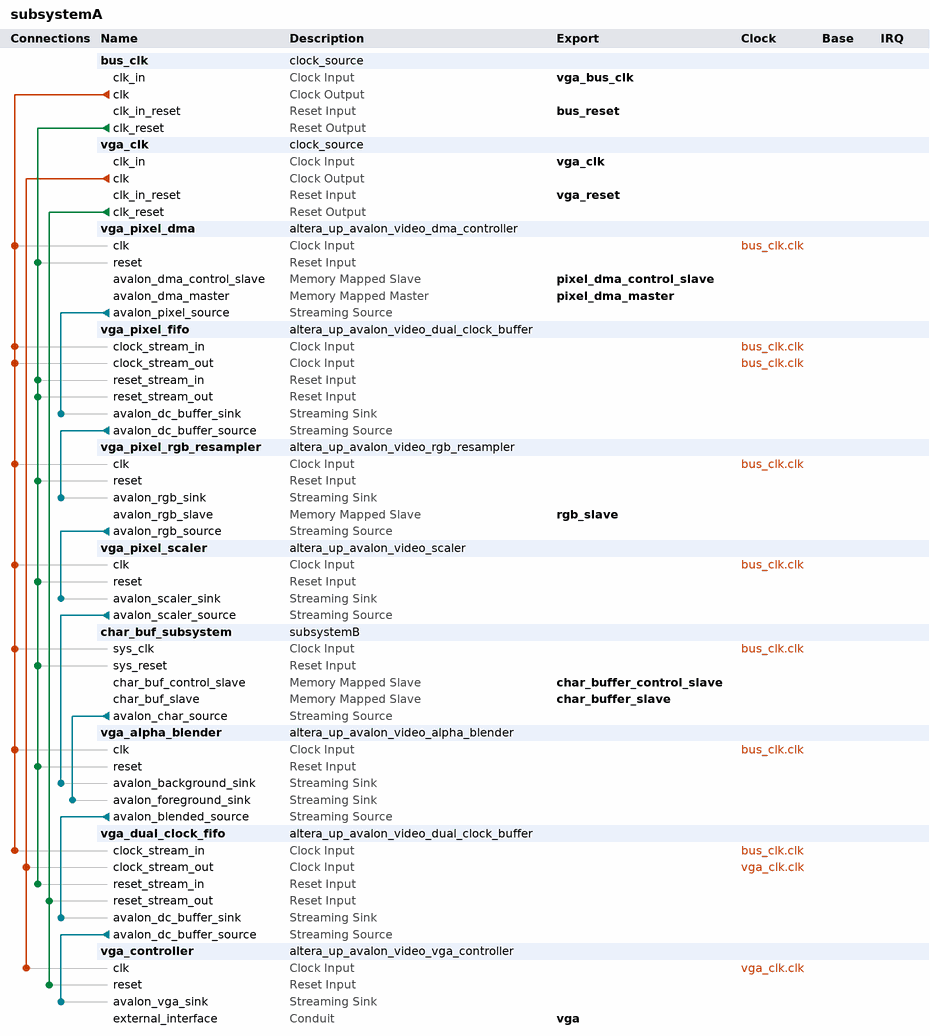
[diagram p0: system contents]
# Platform Designer (Qsys) system subsystemA, Cyclone IV E EP4CE115F29C7
# Parameters at their usual value, and those the tool derives, are not listed.
package require -exact qsys 18.0
create_system subsystemA
set_project_property DEVICE_FAMILY {Cyclone IV E}
set_project_property DEVICE EP4CE115F29C7

add_instance bus_clk clock_source 18.1
set_instance_parameter_value bus_clk clockFrequency 50000000

add_instance vga_clk clock_source 18.1
set_instance_parameter_value vga_clk clockFrequency 25000000

add_instance vga_pixel_dma altera_up_avalon_video_dma_controller 18.0
set_instance_parameter_value vga_pixel_dma addr_mode X-Y
set_instance_parameter_value vga_pixel_dma back_start_address 134217728
set_instance_parameter_value vga_pixel_dma color_bits 16
set_instance_parameter_value vga_pixel_dma color_planes 1
set_instance_parameter_value vga_pixel_dma dma_enabled true
set_instance_parameter_value vga_pixel_dma height 240
set_instance_parameter_value vga_pixel_dma mode {From Memory to Stream}
set_instance_parameter_value vga_pixel_dma start_address 134217728
set_instance_parameter_value vga_pixel_dma width 320

add_instance vga_pixel_fifo altera_up_avalon_video_dual_clock_buffer 18.0
set_instance_parameter_value vga_pixel_fifo color_bits 16
set_instance_parameter_value vga_pixel_fifo color_planes 1

add_instance vga_pixel_rgb_resampler altera_up_avalon_video_rgb_resampler 18.0
set_instance_parameter_value vga_pixel_rgb_resampler alpha 1023
set_instance_parameter_value vga_pixel_rgb_resampler input_type {16-bit RGB}
set_instance_parameter_value vga_pixel_rgb_resampler output_type {30-bit RGB}

add_instance vga_pixel_scaler altera_up_avalon_video_scaler 18.0
set_instance_parameter_value vga_pixel_scaler color_bits 10
set_instance_parameter_value vga_pixel_scaler color_planes 3
set_instance_parameter_value vga_pixel_scaler height_scaling 2
set_instance_parameter_value vga_pixel_scaler width_in 320
set_instance_parameter_value vga_pixel_scaler width_scaling 2

add_instance char_buf_subsystem subsystemB 1.0

add_instance vga_alpha_blender altera_up_avalon_video_alpha_blender 18.0

add_instance vga_dual_clock_fifo altera_up_avalon_video_dual_clock_buffer 18.0
set_instance_parameter_value vga_dual_clock_fifo color_bits 10

add_instance vga_controller altera_up_avalon_video_vga_controller 18.1
set_instance_parameter_value vga_controller board DE10-Standard
set_instance_parameter_value vga_controller resolution {VGA 640x480}

# connections
add_connection bus_clk.clk char_buf_subsystem.sys_clk clock
add_connection bus_clk.clk vga_alpha_blender.clk clock
add_connection bus_clk.clk vga_dual_clock_fifo.clock_stream_in clock
add_connection bus_clk.clk vga_pixel_dma.clk clock
add_connection bus_clk.clk vga_pixel_fifo.clock_stream_in clock
add_connection bus_clk.clk vga_pixel_fifo.clock_stream_out clock
add_connection bus_clk.clk vga_pixel_rgb_resampler.clk clock
add_connection bus_clk.clk vga_pixel_scaler.clk clock
add_connection vga_clk.clk vga_controller.clk clock
add_connection vga_clk.clk vga_dual_clock_fifo.clock_stream_out clock
add_connection bus_clk.clk_reset char_buf_subsystem.sys_reset reset
add_connection bus_clk.clk_reset vga_alpha_blender.reset reset
add_connection bus_clk.clk_reset vga_dual_clock_fifo.reset_stream_in reset
add_connection bus_clk.clk_reset vga_pixel_dma.reset reset
add_connection bus_clk.clk_reset vga_pixel_fifo.reset_stream_in reset
add_connection bus_clk.clk_reset vga_pixel_fifo.reset_stream_out reset
add_connection bus_clk.clk_reset vga_pixel_rgb_resampler.reset reset
add_connection bus_clk.clk_reset vga_pixel_scaler.reset reset
add_connection vga_clk.clk_reset vga_controller.reset reset
add_connection vga_clk.clk_reset vga_dual_clock_fifo.reset_stream_out reset
add_connection char_buf_subsystem.avalon_char_source vga_alpha_blender.avalon_foreground_sink avalon_streaming
add_connection vga_alpha_blender.avalon_blended_source vga_dual_clock_fifo.avalon_dc_buffer_sink avalon_streaming
add_connection vga_dual_clock_fifo.avalon_dc_buffer_source vga_controller.avalon_vga_sink avalon_streaming
add_connection vga_pixel_dma.avalon_pixel_source vga_pixel_fifo.avalon_dc_buffer_sink avalon_streaming
add_connection vga_pixel_fifo.avalon_dc_buffer_source vga_pixel_rgb_resampler.avalon_rgb_sink avalon_streaming
add_connection vga_pixel_rgb_resampler.avalon_rgb_source vga_pixel_scaler.avalon_scaler_sink avalon_streaming
add_connection vga_pixel_scaler.avalon_scaler_source vga_alpha_blender.avalon_background_sink avalon_streaming

# exported interfaces
add_interface bus_reset reset sink
set_interface_property bus_reset EXPORT_OF bus_clk.clk_in_reset
add_interface char_buffer_control_slave avalon slave
set_interface_property char_buffer_control_slave EXPORT_OF char_buf_subsystem.char_buf_control_slave
add_interface char_buffer_slave avalon slave
set_interface_property char_buffer_slave EXPORT_OF char_buf_subsystem.char_buf_slave
add_interface pixel_dma_control_slave avalon slave
set_interface_property pixel_dma_control_slave EXPORT_OF vga_pixel_dma.avalon_dma_control_slave
add_interface pixel_dma_master avalon master
set_interface_property pixel_dma_master EXPORT_OF vga_pixel_dma.avalon_dma_master
add_interface rgb_slave avalon slave
set_interface_property rgb_slave EXPORT_OF vga_pixel_rgb_resampler.avalon_rgb_slave
add_interface vga conduit end
set_interface_property vga EXPORT_OF vga_controller.external_interface
add_interface vga_bus_clk clock sink
set_interface_property vga_bus_clk EXPORT_OF bus_clk.clk_in
add_interface vga_clk clock sink
set_interface_property vga_clk EXPORT_OF vga_clk.clk_in
add_interface vga_reset reset sink
set_interface_property vga_reset EXPORT_OF vga_clk.clk_in_reset

set_interconnect_requirement {$system} qsys_mm.clockCrossingAdapter HANDSHAKE
set_interconnect_requirement {$system} qsys_mm.enableEccProtection FALSE
set_interconnect_requirement {$system} qsys_mm.insertDefaultSlave FALSE
set_interconnect_requirement {$system} qsys_mm.maxAdditionalLatency 1

save_system subsystemA.qsys
